# Altium schematic sheet HeaderPins.SchDoc
size A; SheetNumber: 6; SheetTotal: 6
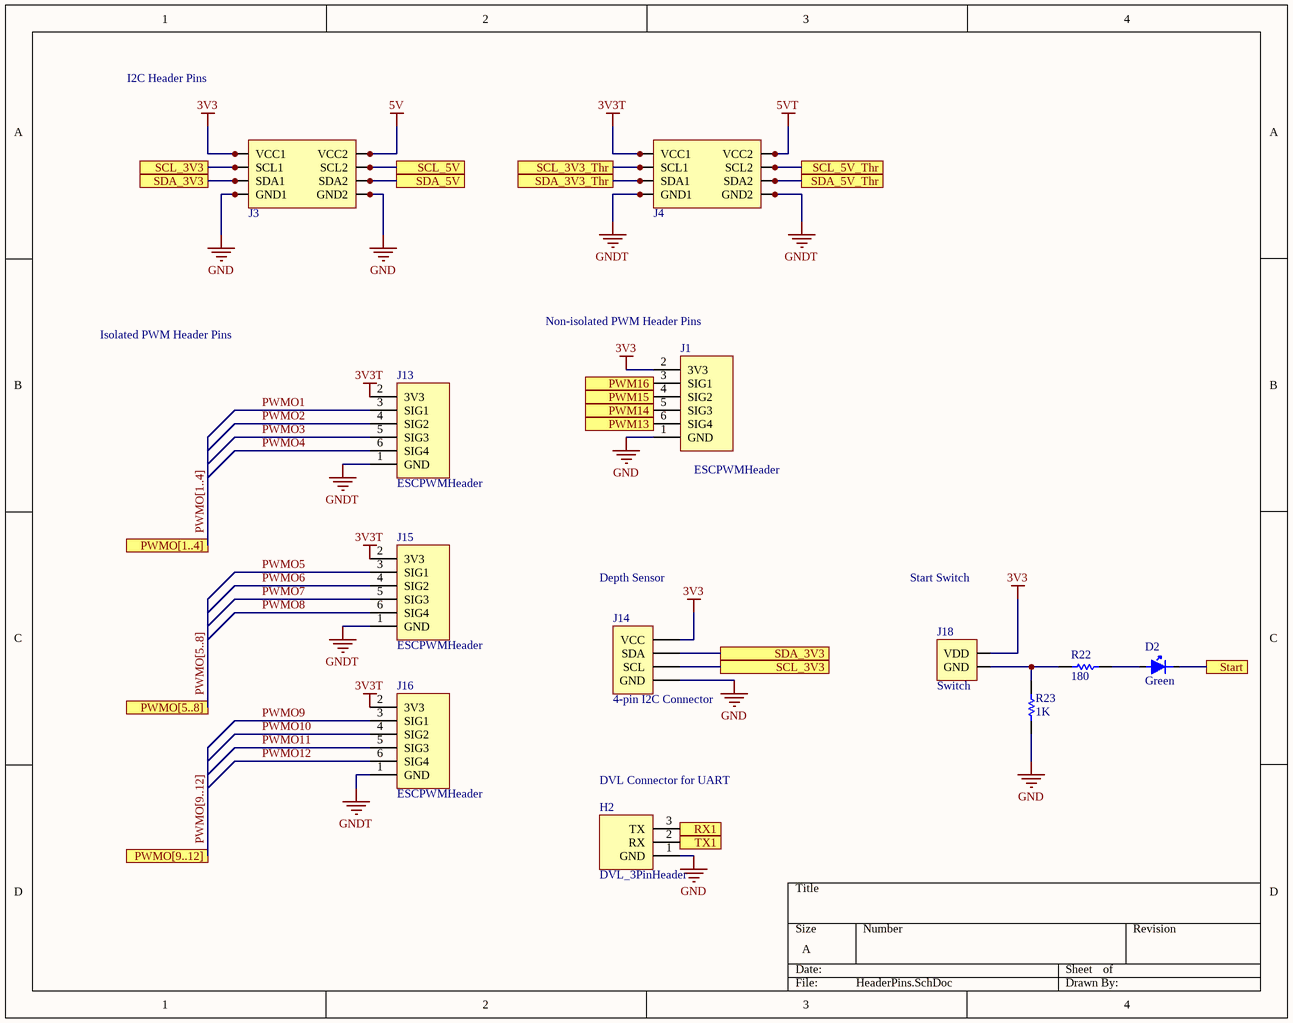
[diagram p0: HeaderPins.SchDoc]

## Parts
D2  Green  [LED-D12]
H2  DVL_3PinHeader  [SAMTEC-TSW-103-07-X-S]
J1  ESCPWMHeader  [CON12_3X4_TU_TSW_SAI]
J3  i2c-2x2  [37216-62M3-004PL]  (value not drawn)
J4  i2c-2x2  [37216-62M3-004PL]  (value not drawn)
J13  ESCPWMHeader  [37212-62M3-003PL]
J14  4-pin I2C Connector  [CON4_1X4_U_DF13]
J15  ESCPWMHeader  [37212-62M3-003PL]
J16  ESCPWMHeader  [37212-62M3-003PL]
J18  Switch  [2PinHeader]
R22  180  [RESC1609X55X30NL10T20]
R23  1K  [RESC1609X55X30NL10T20]

## Ports
PWM13, PWM14, PWM15, PWM16, PWMO[1..4], PWMO[5..8], PWMO[9..12], RX1, SCL_3V3, SCL_3V3_Thr, SCL_5V, SCL_5V_Thr, SDA_3V3, SDA_3V3_Thr, SDA_5V, SDA_5V_Thr, Start, TX1

## Nets
3V3: J1.2(3V3) J3.1 J3.5(VCC1) J14.1(VCC) J18.2(VDD)
3V3T: J4.1 J4.5(VCC1) J13.2(3V3) J15.2(3V3) J16.2(3V3)
5V: J3.9 J3.13(VCC2)
5VT: J4.9 J4.13(VCC2)
GND: H2.1(GND) J1.1(GND) J3.4 J3.8(GND1) J3.12 J3.16(GND2) J14.4(GND) R23.1
GNDT: J4.4 J4.8(GND1) J4.12 J4.16(GND2) J13.1(GND) J15.1(GND) J16.1(GND)
PWM13: J1.6(SIG4) ; port PWM13
PWM14: J1.5(SIG3) ; port PWM14
PWM15: J1.4(SIG2) ; port PWM15
PWM16: J1.3(SIG1) ; port PWM16
PWMO1: J13.3(SIG1)
PWMO2: J13.4(SIG2)
PWMO3: J13.5(SIG3)
PWMO4: J13.6(SIG4)
PWMO5: J15.3(SIG1)
PWMO6: J15.4(SIG2)
PWMO7: J15.5(SIG3)
PWMO8: J15.6(SIG4)
PWMO9: J16.3(SIG1)
PWMO10: J16.4(SIG2)
PWMO11: J16.5(SIG3)
PWMO12: J16.6(SIG4)
RX1: H2.3(TX) ; port RX1
SCL_3V3: J3.2 J3.6(SCL1) J14.3(SCL) ; port SCL_3V3
SCL_3V3_Thr: J4.2 J4.6(SCL1) ; port SCL_3V3_Thr
SCL_5V: J3.10 J3.14(SCL2) ; port SCL_5V
SCL_5V_Thr: J4.10 J4.14(SCL2) ; port SCL_5V_Thr
SDA_3V3: J3.3 J3.7(SDA1) J14.2(SDA) ; port SDA_3V3
SDA_3V3_Thr: J4.3 J4.7(SDA1) ; port SDA_3V3_Thr
SDA_5V: J3.11 J3.15(SDA2) ; port SDA_5V
SDA_5V_Thr: J4.11 J4.15(SDA2) ; port SDA_5V_Thr
Start: D2.C ; port Start
TX1: H2.2(RX) ; port TX1
NetD2_A: D2.A R22.1
NetJ18_1: J18.1(GND) R22.2 R23.2

## Buses and harness runs
bus PWMO[1..4] = port PWMO[1..4]
bus PWMO[5..8] = port PWMO[5..8]
bus PWMO[9..12] = port PWMO[9..12]

## Notes on the sheet
- I2C Header Pins
- Isolated PWM Header Pins
- (near J1) Non-isolated PWM Header Pins
- Depth Sensor
- Start Switch
- (near H2) DVL Connector for UART

## Library data of the parts
D2 = SML-D12FWT86: LED GREEN DIFFUSED 1608 SMD; Manufacturer 1: Rohm; Lens Color: White; Luminous Intensity: 18mcd; Test Current: 20mA; Dominant Wavelength: 565nm; Lens Style: Colored,Rectangular; Forward Voltage: 2.2V; Number of LEDs: 1; Supplier 1: Digi-Key; Supplier Part Number 1: 846-1176-1-ND; Manufacturer Part Number 1: SML-D12FWT86; Stock 1: 10669; Pricing 1: 1=0.50000, 10=0.35300, 100=0.20580, 500=0.14112, 1000=0.11760 (USD); RoHS: Yes; Mount: Surface Mount; Case/Package: 0603; Number of Pins: 2; Color: Green; Case Code (Metric): 1608; Case Code (Imperial): 0603; Packaging: Tape and Reel; Lens Transparency: Diffused; Length: 1.6mm; Height: 0.65mm; Width: 0.8mm; Lead Free: Lead Free; ComponentLink1URL: http://www.mouser.com/ds/2/348/sml-d12y3w_fw-1018563.pdf?src-supplier=Mouser; ComponentLink1Description: http://www.mouser.com/ds/2/348/sml-d12y3w_fw-1018563.pdf?src-supplier=Mouser; ComponentLink2URL: http://www.rohm.com/web/global/datasheet/SML-D12Y3W?src-supplier=Digi-Key; ComponentLink2Description: http://www.rohm.com/web/global/datasheet/SML-D12Y3W?src-supplier=Digi-Key; ComponentLink3URL: http://rohmfs.rohm.com/en/products/databook/datasheet/opto/led/chip_mono/sml-d12.pdf?src-supplier=Avnet; ComponentLink3Description: http://rohmfs.rohm.com/en/products/databook/datasheet/opto/led/chip_mono/sml-d12.pdf?src-supplier=Avnet; ComponentLink4URL: https://www.rohm.com/datasheet/SML-D12Y3W?src-supplier=Digi-Key; ComponentLink4Description: https://www.rohm.com/datasheet/SML-D12Y3W?src-supplier=Digi-Key
J1 J13 J15 J16 = ESCPWMHeader: 4x3 Header Block; pin to pad: 1>1+4+7+10 2>2+5+8+11 4>6 5>9 6>12; Supplier 1: Digi-Key; Supplier Part Number 1: SAM12310-ND; Supplier 2: Digi-Key; Supplier Part Number 2: SAM8995-ND
J14 = DF13C-4P-1.25V(51): Headers & Wire Housings 1.25MM V PCB HEADER 4P SMT GOLD; pin to pad: 2>3 3>2; Manufacturer 1: Hirose; Number of Contacts: 4; Current Rating: 1A; Voltage Rating: 150V; Contact Resistance: 30mR; Supplier 1: Digi-Key; Supplier Part Number 1: H126000CT-ND; Manufacturer Part Number 1: DF13C-4P-1.25V(51); Stock 1: 692; Pricing 1: 1=0.86000, 10=0.75700, 100=0.65340, 500=0.53460 (USD); RoHS: Yes; Contact Plating: Gold; Contact Material: Brass; Housing Color: Beige; Housing Material: Polyamide; Min Operating Temperature: -35°C; Max Operating Temperature: 85°C; Number of Rows: 1; Termination: Solder; Packaging: Tape and Reel; Number of Positions: 4; Contact Gender: Male; Max Current Rating: 1A; Max Voltage Rating (AC): 150V; Orientation: Straight; Length: 9.65mm; Pitch: 1.25mm; Depth: 3.4mm; Radiation Hardening: No; Lead Free: Lead Free; ComponentLink1URL: https://datasheet.ciiva.com/26898/getdatasheetpartid-434101-26898082.pdf?src-supplier=Verical; ComponentLink1Description: https://datasheet.ciiva.com/26898/getdatasheetpartid-434101-26898082.pdf?src-supplier=Verical; ComponentLink2URL: https://datasheet.ciiva.com/5153/en-df13-20130411-5153743.pdf?src-supplier=Mouser; ComponentLink2Description: https://datasheet.ciiva.com/5153/en-df13-20130411-5153743.pdf?src-supplier=Mouser
J18 = Start_Switch: Supplier 1: Digi-Key; Supplier Part Number 1: 3M9457-36-ND
R22 = TNPW0603180RBEEA: RES 180 OHM 0.1% 1/8W 0603; Tolerance: 1%; Resistance: 1kR; Temperature Coefficient: 25ppm/°C; Power Rating: 100mW; Voltage Rating: 75V; RoHS: Yes; Mount: Surface Mount; Case/Package: 0603; Weight: 7.1E-05oz; Contact Plating: Tin; Case Code (Metric): 1608; Case Code (Imperial): 0603; Min Operating Temperature: -55°C; Max Operating Temperature: 125°C; Composition: Thin Film; Packaging: Tape and Reel; Package Quantity: 1; Number of Terminations: 2; Termination: SMD/SMT; Military Standard: Not; Max Power Dissipation: 100mW; Voltage Rating (DC): 75V; Features: Moisture Resistant,Automotive AEC-Q200,Anti-Sulfur; Length: 1.6mm; Height: 0.45mm; Width: 0.033inch; Depth: 0.85mm; Radiation Hardening: No; REACH SVHC: Unknown; Lead Free: Lead Free; ComponentLink1URL: https://datasheet.ciiva.com/2528/tnpw-e3-2528472.pdf?src-supplier=Digi-Key; ComponentLink1Description: https://datasheet.ciiva.com/2528/tnpw-e3-2528472.pdf?src-supplier=Digi-Key; ComponentLink2URL: https://datasheet.ciiva.com/2528/tnpw-e3-2528473.pdf?src-supplier=Digi-Key; ComponentLink2Description: https://datasheet.ciiva.com/2528/tnpw-e3-2528473.pdf?src-supplier=Digi-Key; ComponentLink3URL: https://datasheet.ciiva.com/9112/tnpw-e3-9112138.pdf?src-supplier=Avnet; ComponentLink3Description: https://datasheet.ciiva.com/9112/tnpw-e3-9112138.pdf?src-supplier=Avnet; ComponentLink4URL: https://datasheet.ciiva.com/16391/tnpw-e3-16391675.pdf?src-supplier=Future+Electronics; ComponentLink4Description: https://datasheet.ciiva.com/16391/tnpw-e3-16391675.pdf?src-supplier=Future+Electronics; ComponentLink5URL: https://datasheet.ciiva.com/9112/tnpw-e3-9112141.pdf?src-supplier=Avnet; ComponentLink5Description: https://datasheet.ciiva.com/9112/tnpw-e3-9112141.pdf?src-supplier=Avnet; ComponentLink6URL: https://datasheet.ciiva.com/16782/70201627-16782047.pdf?src-supplier=Allied+Electronics; ComponentLink6Description: https://datasheet.ciiva.com/16782/70201627-16782047.pdf?src-supplier=Allied+Electronics; Supplier 1: Digi-Key; Supplier Part Number 1: 541-4531-1-ND
R23 = TNPW06031K00BEEA: RES 1K OHM 0.1% 1/8W 0603; Tolerance: 1%; Resistance: 1kR; Temperature Coefficient: 25ppm/°C; Power Rating: 100mW; Voltage Rating: 75V; RoHS: Yes; Mount: Surface Mount; Case/Package: 0603; Weight: 7.1E-05oz; Contact Plating: Tin; Case Code (Metric): 1608; Case Code (Imperial): 0603; Min Operating Temperature: -55°C; Max Operating Temperature: 125°C; Composition: Thin Film; Packaging: Tape and Reel; Package Quantity: 1; Number of Terminations: 2; Termination: SMD/SMT; Military Standard: Not; Max Power Dissipation: 100mW; Voltage Rating (DC): 75V; Features: Moisture Resistant,Automotive AEC-Q200,Anti-Sulfur; Length: 1.6mm; Height: 0.45mm; Width: 0.033inch; Depth: 0.85mm; Radiation Hardening: No; REACH SVHC: Unknown; Lead Free: Lead Free; ComponentLink1URL: https://datasheet.ciiva.com/2528/tnpw-e3-2528472.pdf?src-supplier=Digi-Key; ComponentLink1Description: https://datasheet.ciiva.com/2528/tnpw-e3-2528472.pdf?src-supplier=Digi-Key; ComponentLink2URL: https://datasheet.ciiva.com/2528/tnpw-e3-2528473.pdf?src-supplier=Digi-Key; ComponentLink2Description: https://datasheet.ciiva.com/2528/tnpw-e3-2528473.pdf?src-supplier=Digi-Key; ComponentLink3URL: https://datasheet.ciiva.com/9112/tnpw-e3-9112138.pdf?src-supplier=Avnet; ComponentLink3Description: https://datasheet.ciiva.com/9112/tnpw-e3-9112138.pdf?src-supplier=Avnet; ComponentLink4URL: https://datasheet.ciiva.com/16391/tnpw-e3-16391675.pdf?src-supplier=Future+Electronics; ComponentLink4Description: https://datasheet.ciiva.com/16391/tnpw-e3-16391675.pdf?src-supplier=Future+Electronics; ComponentLink5URL: https://datasheet.ciiva.com/9112/tnpw-e3-9112141.pdf?src-supplier=Avnet; ComponentLink5Description: https://datasheet.ciiva.com/9112/tnpw-e3-9112141.pdf?src-supplier=Avnet; ComponentLink6URL: https://datasheet.ciiva.com/16782/70201627-16782047.pdf?src-supplier=Allied+Electronics; ComponentLink6Description: https://datasheet.ciiva.com/16782/70201627-16782047.pdf?src-supplier=Allied+Electronics; Supplier 1: Digi-Key; Supplier Part Number 1: TNP1.00KAACT-ND
J3 J4 = i2c-2x2: Supplier 1: Digi-Key; Supplier Part Number 1: 952-1772-ND